# EAGLE schematic Charger Tractive System (EAGLE 9.6.2)
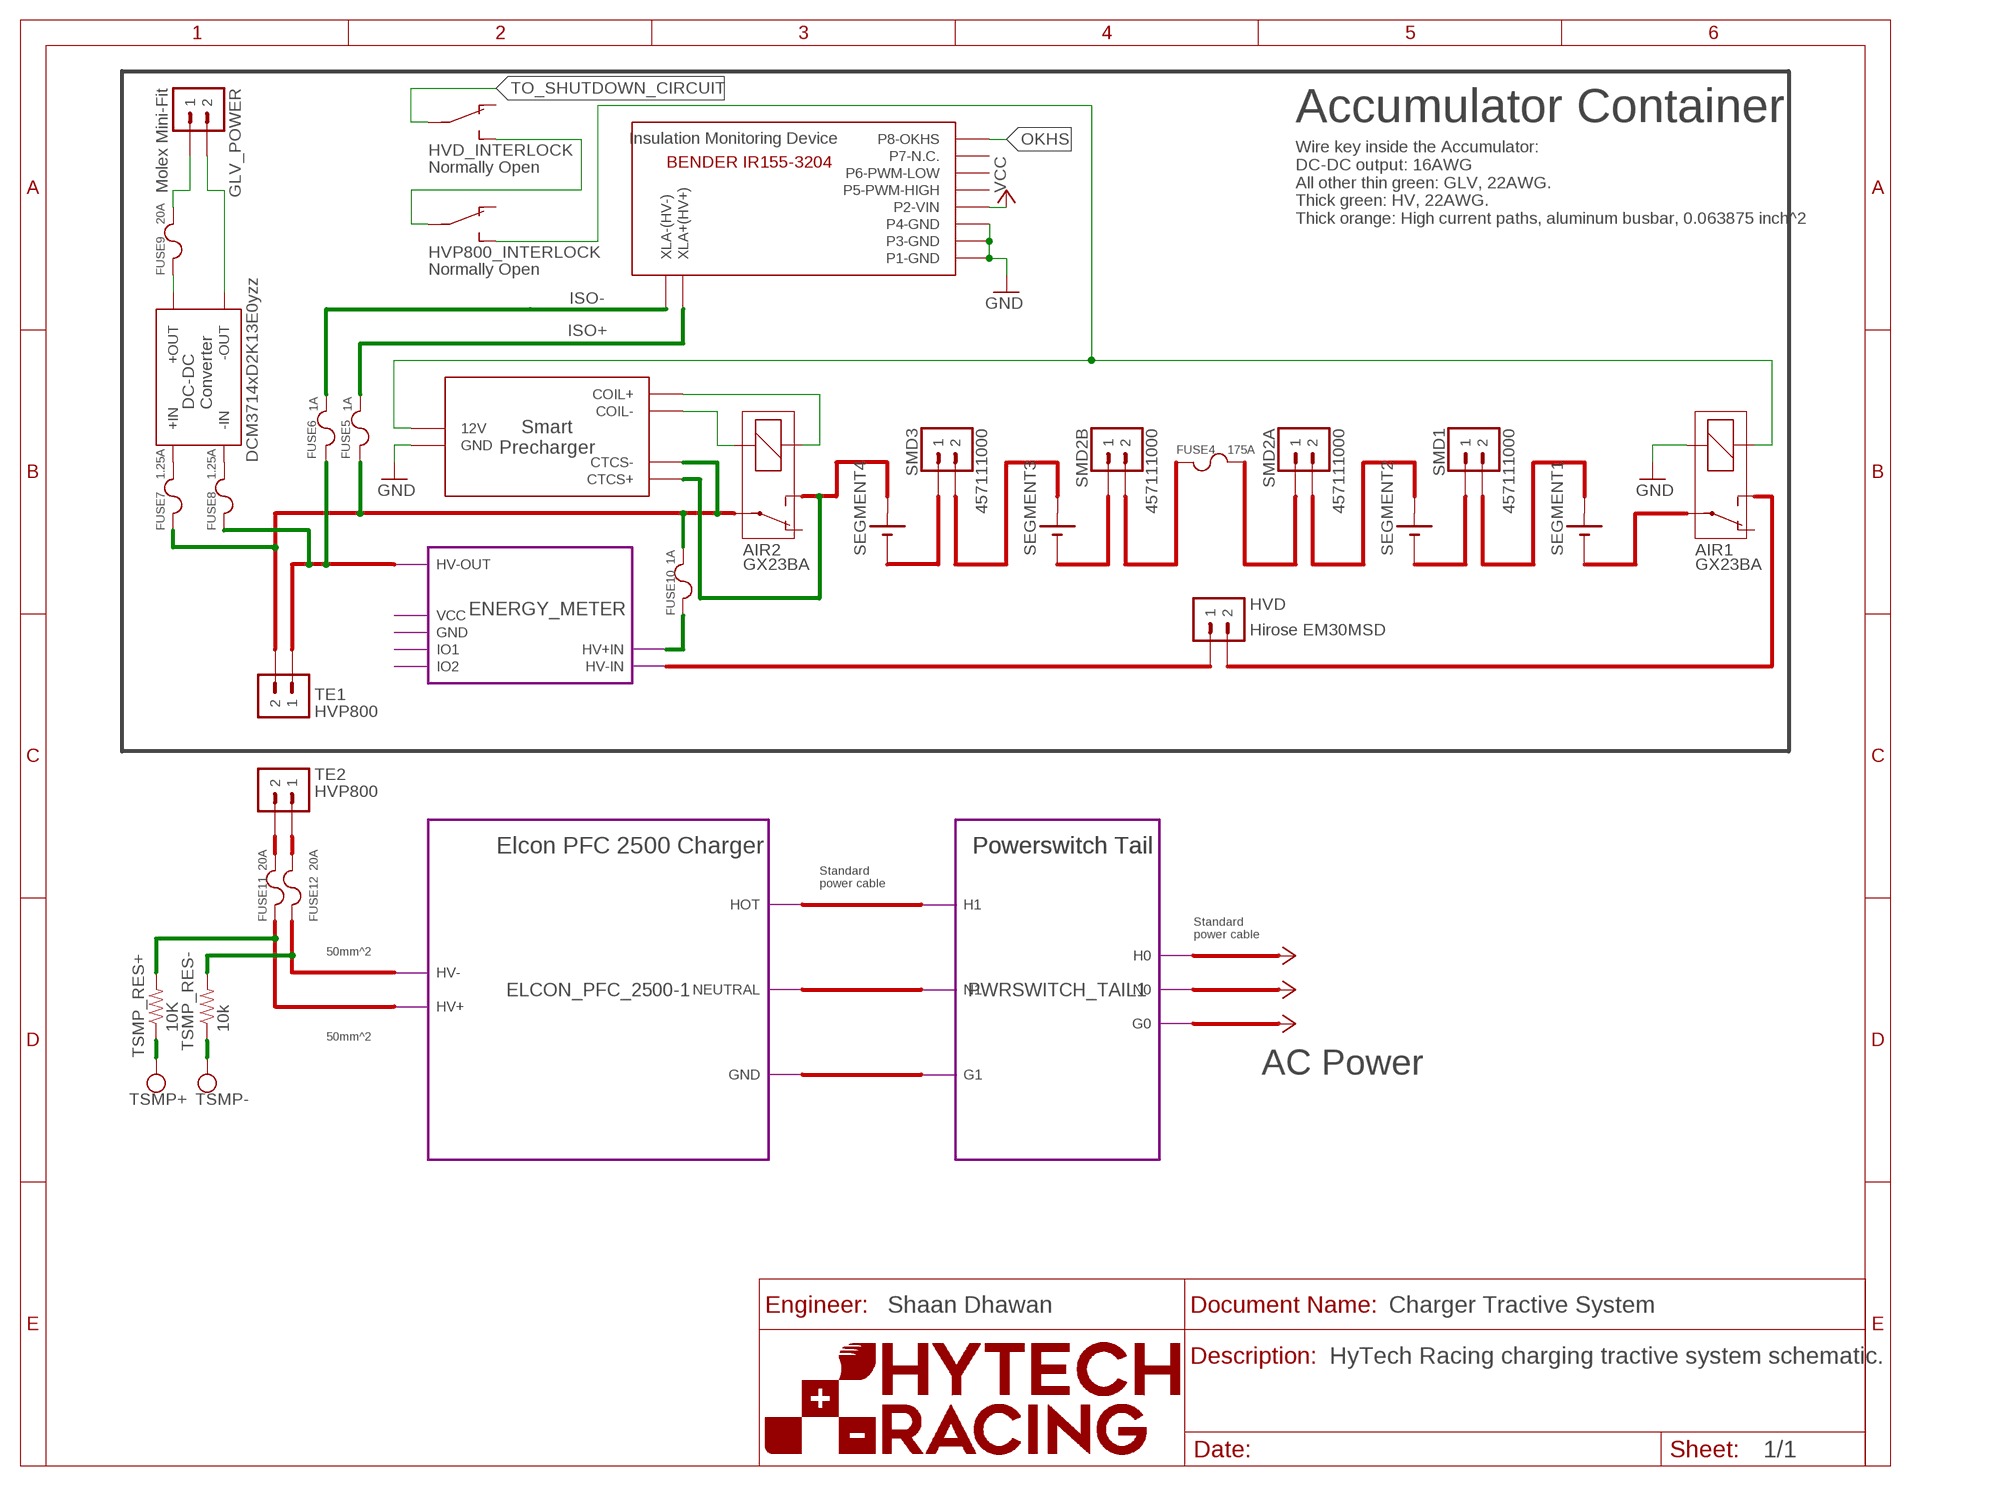
[diagram p0: schematic, sheet 1]
U$1 (FRAME_A_L): ORIENTATION: LANDSCAPE; SIZE: A

## Parts
AIR1  GX23BA  RELAY  (no package)
AIR2  GX23BA  RELAY  (no package)
FUSE4  175A  FUSE  (no package)
FUSE5  1A  FUSE  (no package)
FUSE6  1A  FUSE  (no package)
FUSE7  1.25A  FUSE  (no package)
FUSE8  1.25A  FUSE  (no package)
FUSE9  20A  FUSE  (no package)
FUSE10  1A  FUSE  (no package)
FUSE11  20A  FUSE  (no package)
FUSE12  20A  FUSE  (no package)
GLV_POWER  Molex Mini-Fit  M02  (no package)
HVD  Hirose EM30MSD  M02  (no package)
HVD_INTERLOCK  Normally Open  SWITCH_SPST  (no package)
HVP800_INTERLOCK  Normally Open  SWITCH_SPST  (no package)
SEGMENT1  BATTERY_1_CELL  (no package)
SEGMENT2  BATTERY_1_CELL  (no package)
SEGMENT3  BATTERY_1_CELL  (no package)
SEGMENT4  BATTERY_1_CELL  (no package)
SMD1  457111000  M02  (no package)
SMD2A  457111000  M02  (no package)
SMD2B  457111000  M02  (no package)
SMD3  457111000  M02  (no package)
TE1  HVP800  M02  (no package)
TE2  HVP800  M02  (no package)
TSMP_RES+  10K  RESISTOR10W  [10W_RESISTOR_VISHAY]
TSMP_RES-  10k  RESISTOR10W  [10W_RESISTOR_VISHAY]
U$2  TEST_POINT  [TEST_POINT]
U$3  TEST_POINT  [TEST_POINT]
U$4  SMART_PRECHARGER  (no package)
U$5  BENDER_IR155-3204  (no package)
U$6  DC-DC_CONVERTER  (no package)

## Module instances
ENERGY_METER = ENERGY_METER
ELCON_PFC_2500-1 = ELCON_PFC_2500
PWRSWITCH_TAIL1 = PWRSWITCH_TAIL

## Nets
GND: AIR1.2 U$4.GND U$5.P1-GND U$5.P3-GND U$5.P4-GND
ISO+: FUSE5.2 U$5.XLA+(HV+)
ISO-: FUSE6.2 U$5.XLA-(HV-)
N$1: FUSE8.1
N$2: FUSE6.1
N$3: TSMP_RES+.2
N$4: FUSE5.1
N$5: TSMP_RES-.2
N$6: TSMP_RES+.1 U$3.P$1
N$7: HVD_INTERLOCK.S HVP800_INTERLOCK.P
N$8: TSMP_RES-.1 U$2.P$1
N$9: FUSE10.1 ; port ENERGY_METER.HV+IN
N$10: AIR2.2 U$4.COIL-
N$11: AIR2.1 U$4.COIL+
N$12: FUSE10.2
N$15: FUSE7.1
N$16: AIR1.1 HVP800_INTERLOCK.S U$4.12V
N$17: FUSE7.2 U$6.+IN
N$18: FUSE8.2 U$6.-IN
N$19: FUSE9.1 U$6.+OUT
N$20: FUSE9.2 GLV_POWER.1
N$21: GLV_POWER.2 U$6.-OUT
N$23: U$4.CTCS+
N$25: U$4.CTCS-
OKHS: U$5.P8-OKHS
TO_SHUTDOWN_CIRCUIT: HVD_INTERLOCK.P
VCC: U$5.P2-VIN
Unconnected: AIR1.O AIR1.P AIR1.S AIR2.O AIR2.P AIR2.S FUSE4.1 FUSE4.2 FUSE11.1 FUSE11.2 FUSE12.1 FUSE12.2 HVD.1 HVD.2 HVD_INTERLOCK.O HVP800_INTERLOCK.O SEGMENT1.+ SEGMENT1.- SEGMENT2.+ SEGMENT2.- SEGMENT3.+ SEGMENT3.- SEGMENT4.+ SEGMENT4.- SMD1.1 SMD1.2 SMD2A.1 SMD2A.2 SMD2B.1 SMD2B.2 SMD3.1 SMD3.2 TE1.1 TE1.2 TE2.1 TE2.2 U$5.P5-PWM-HIGH U$5.P6-PWM-LOW U$5.P7-N.C.

## Notes on the sheet
- Accumulator Container
- Insulation Monitoring Device
- Wire key inside the Accumulator:
  DC-DC output: 16AWG
  All other thin green: GLV, 22AWG.
  Thick green: HV, 22AWG.
  Thick orange: High current paths, aluminum busbar, 0.063875 inch^2
- DCM3714xD2K13E0yzz
- Elcon PFC 2500 Charger | Powerswitch Tail | Powerswitch Tail
- Standard
  power cable
- Standard
  power cable
- 50mm^2
- 50mm^2
- AC Power
- TSMP+ | TSMP-
- Shaan Dhawan
- HyTech Racing charging tractive system schematic.

## Library data of the parts
AIR1 AIR2 = HyTechSymbols:RELAY: RELAY 1 x switch
FUSE4-FUSE12 = HyTechSymbols:FUSE: Generic Fuse
GLV_POWER HVD SMD1 SMD2A SMD2B SMD3 TE1 TE2 = HyTechSymbols:M02: Generic 2-pin connector
HVD_INTERLOCK HVP800_INTERLOCK = HyTechSymbols:SWITCH_SPST: Single Pull Single Throw Switch
SEGMENT1-SEGMENT4 = HyTechSymbols:BATTERY_1_CELL: Generic 1-cell battery Source: Sonnenschein
TSMP_RES+ TSMP_RES- = HyTechDevices:RESISTOR: Resistor Basic schematic elements and footprints for 0603, 1206, and PTH resistors.
U$2 U$3 = HyTechDevices:TEST_POINT: Keystone Electronics Test Point 5005
U$4 = HyTechSymbols:SMART_PRECHARGER: Smart Precharger http://www.zeva.com.au/Products/datasheets/SmartPrechargerV1-3.pdf
U$5 = HyTechSymbols:BENDER_IR155-3204: Bender IR155-3204 Insulation Monitoring Device Datasheet <http://www.bender-es.com/fileadmin/products/doc/IR155-32xx-V004_D00115_D_XXEN.pdf>
U$6 = HyTechSymbols:DC-DC_CONVERTER

## Module ENERGY_METER
Ports: HV+IN(in) HV-OUT(in) HV-IN(out) VCC(in) GND(out) IO1(io) IO2(io)

### Library data of the parts

## Module ELCON_PFC_2500
Ports: HV-(io) HV+(io) NEUTRAL(io) HOT(io) GND(io)

### Library data of the parts

## Module PWRSWITCH_TAIL
Ports: H1(io) N1(io) G1(io) N0(io) H0(io) G0(io)

### Library data of the parts